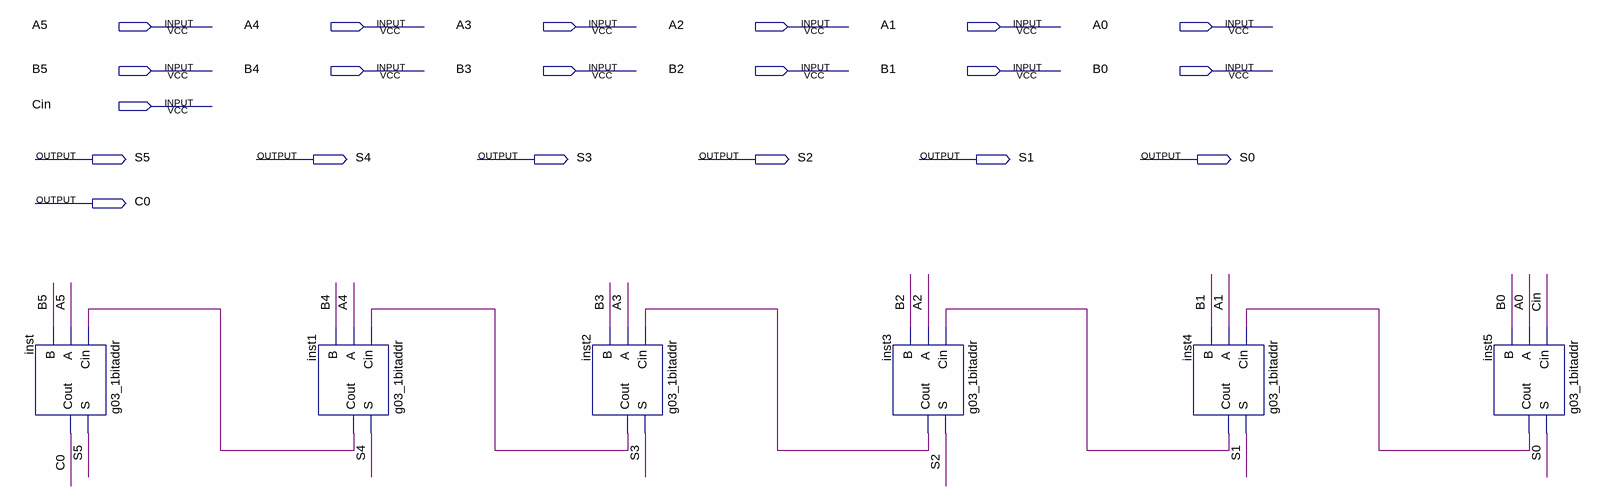
[diagram p0: schematic sheet]
// Quartus schematic g03_6bitaddr.bdf as structural Verilog: 6 symbols, 20 pins
module g03_6bitaddr (
  input  A5,
  input  A4,
  input  A3,
  input  A2,
  input  A1,
  input  A0,
  input  B5,
  input  B4,
  input  B3,
  input  B2,
  input  B1,
  input  B0,
  input  Cin,
  output S5,
  output S4,
  output S3,
  output S2,
  output S1,
  output S0,
  output C0
);

  wire inst1_cout, inst2_cout, inst3_cout, inst4_cout, inst5_cout;

  g03_1bitaddr inst (.Cin(inst1_cout), .A(A5), .B(B5), .S(S5), .Cout(C0));
  g03_1bitaddr inst1 (.Cin(inst2_cout), .A(A4), .B(B4), .S(S4), .Cout(inst1_cout));
  g03_1bitaddr inst2 (.Cin(inst3_cout), .A(A3), .B(B3), .S(S3), .Cout(inst2_cout));
  g03_1bitaddr inst3 (.Cin(inst4_cout), .A(A2), .B(B2), .S(S2), .Cout(inst3_cout));
  g03_1bitaddr inst4 (.Cin(inst5_cout), .A(A1), .B(B1), .S(S1), .Cout(inst4_cout));
  g03_1bitaddr inst5 (.Cin(Cin), .A(A0), .B(B0), .S(S0), .Cout(inst5_cout));
endmodule
